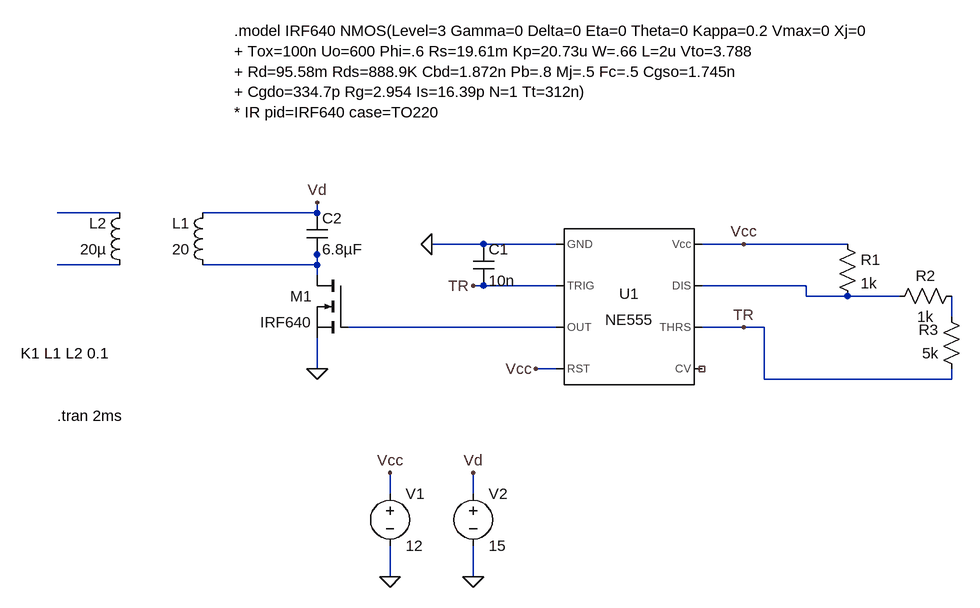
[diagram p0: schematic Flyback 555.asc]
Flyback 555.asc, the LTspice schematic file:
Version 4.1
SHEET 1 880 680
WIRE -576 32 -672 32
WIRE -272 32 -272 16
WIRE -272 32 -448 32
WIRE -16 80 -96 80
WIRE 96 80 -16 80
WIRE 384 80 320 80
WIRE 544 80 384 80
WIRE -272 96 -272 80
WIRE -576 112 -672 112
WIRE -272 112 -272 96
WIRE -272 112 -448 112
WIRE -272 128 -272 112
WIRE -16 144 -32 144
WIRE 96 144 -16 144
WIRE 480 144 320 144
WIRE 480 160 480 144
WIRE 544 160 480 160
WIRE 624 160 544 160
WIRE 704 192 704 160
WIRE 96 208 -224 208
WIRE 384 208 320 208
WIRE 416 208 384 208
WIRE -272 272 -272 224
WIRE 96 272 64 272
WIRE 416 288 416 208
WIRE 704 288 704 272
WIRE 704 288 416 288
WIRE -160 464 -160 432
WIRE -32 464 -32 432
WIRE -160 592 -160 544
WIRE -32 592 -32 544
FLAG 384 208 TR
FLAG -32 144 TR
FLAG 384 80 Vcc
FLAG 64 272 Vcc
FLAG -96 80 0
FLAG -272 272 0
FLAG -272 16 Vd
FLAG -160 592 0
FLAG -32 592 0
FLAG -32 432 Vd
FLAG -160 432 Vcc
SYMBOL Misc\\NE555 208 176 R0
SYMATTR InstName U1
SYMBOL res 528 64 R0
SYMATTR InstName R1
SYMATTR Value 1k
SYMBOL res 720 144 R90
WINDOW 0 0 56 VBottom 2
WINDOW 3 32 56 VTop 2
SYMATTR InstName R2
SYMATTR Value 1k
SYMBOL res 720 288 R180
WINDOW 0 36 76 Left 2
WINDOW 3 36 40 Left 2
SYMATTR InstName R3
SYMATTR Value 5k
SYMBOL cap -32 80 R0
SYMATTR InstName C1
SYMATTR Value 10n
SYMBOL nmos -224 128 M0
SYMATTR InstName M1
SYMATTR Value IRF640
SYMBOL cap -288 32 R0
SYMATTR InstName C2
SYMATTR Value 6.8µF
SYMBOL voltage -160 448 R0
SYMATTR InstName V1
SYMATTR Value 12
SYMBOL voltage -32 448 R0
WINDOW 123 0 0 Left 0
WINDOW 39 0 0 Left 0
SYMATTR InstName V2
SYMATTR Value 15
SYMBOL ind -432 128 R180
WINDOW 0 36 80 Left 2
WINDOW 3 36 40 Left 2
SYMATTR InstName L1
SYMATTR Value 20
SYMATTR Type ind
SYMATTR SpiceLine Rser=0
SYMBOL ind -560 128 R180
WINDOW 0 36 80 Left 2
WINDOW 3 36 40 Left 2
SYMATTR InstName L2
SYMATTR Value 20µ
SYMATTR Type ind
SYMATTR SpiceLine Rser=1m
TEXT -400 -248 Left 2 !.model IRF640 NMOS(Level=3 Gamma=0 Delta=0 Eta=0 Theta=0 Kappa=0.2 Vmax=0 Xj=0\n+ Tox=100n Uo=600 Phi=.6 Rs=19.61m Kp=20.73u W=.66 L=2u Vto=3.788\n+ Rd=95.58m Rds=888.9K Cbd=1.872n Pb=.8 Mj=.5 Fc=.5 Cgso=1.745n\n+ Cgdo=334.7p Rg=2.954 Is=16.39p N=1 Tt=312n)\n* IR pid=IRF640 case=TO220
TEXT -672 344 Left 2 !.tran 2ms
TEXT -728 248 Left 2 !K1 L1 L2 0.1

The netlist it stands for:
* Flyback 555.asc
X§U1 0 TR N006 Vcc NC_01 TR N004 Vcc NE555  ; pins GND TRIG OUT RST CV THRS DIS Vcc
R1 Vcc N004 1k
R2 N005 N004 1k
R3 TR N005 5k
C1 0 TR 10n
M1 N002 N006 0 0 IRF640
C2 Vd N002 6.8µF
V1 Vcc 0 12
V2 Vd 0 15
L1 N002 Vd 20 Rser=0
L2 N003 N001 20µ Rser=1m
.model NMOS NMOS
.model PMOS PMOS
.lib standard.mos
.model IRF640 NMOS(Level=3 Gamma=0 Delta=0 Eta=0 Theta=0 Kappa=0.2 Vmax=0 Xj=0
+ Tox=100n Uo=600 Phi=.6 Rs=19.61m Kp=20.73u W=.66 L=2u Vto=3.788
+ Rd=95.58m Rds=888.9K Cbd=1.872n Pb=.8 Mj=.5 Fc=.5 Cgso=1.745n
+ Cgdo=334.7p Rg=2.954 Is=16.39p N=1 Tt=312n)
* IR pid=IRF640 case=TO220
.tran 2ms
K1 L1 L2 0.1
.lib NE555.sub
.backanno
.end